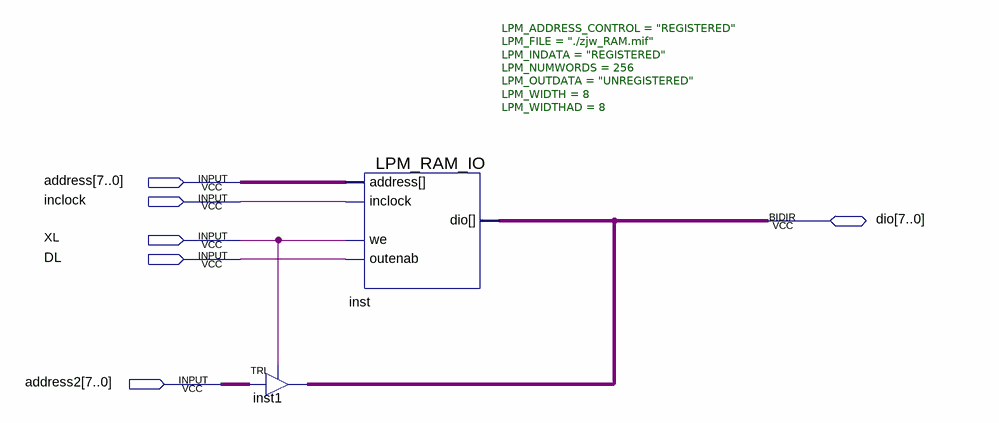
[diagram p0: schematic sheet]
// Quartus schematic zjw_RAM.bdf as structural Verilog: 2 symbols, 6 pins
module zjw_RAM (
  input  [7:0] address,
  input  inclock,
  input  XL,
  input  DL,
  input  [7:0] address2,
  inout  [7:0] dio
);

  TRI inst1[7:0] (.IN(address2), .OE(XL), .OUT(dio));
  LPM_RAM_IO #(.LPM_ADDRESS_CONTROL("REGISTERED"), .LPM_FILE("./zjw_RAM.mif"), .LPM_INDATA("REGISTERED"), .LPM_NUMWORDS(256), .LPM_OUTDATA("UNREGISTERED"), .LPM_WIDTH(8), .LPM_WIDTHAD(8)) inst (
    .address(address), .inclock(inclock), .we(XL), .outenab(DL), .dio(dio));
endmodule
